# Altium schematic sheet 5VBulkhead.SchDoc
size A4
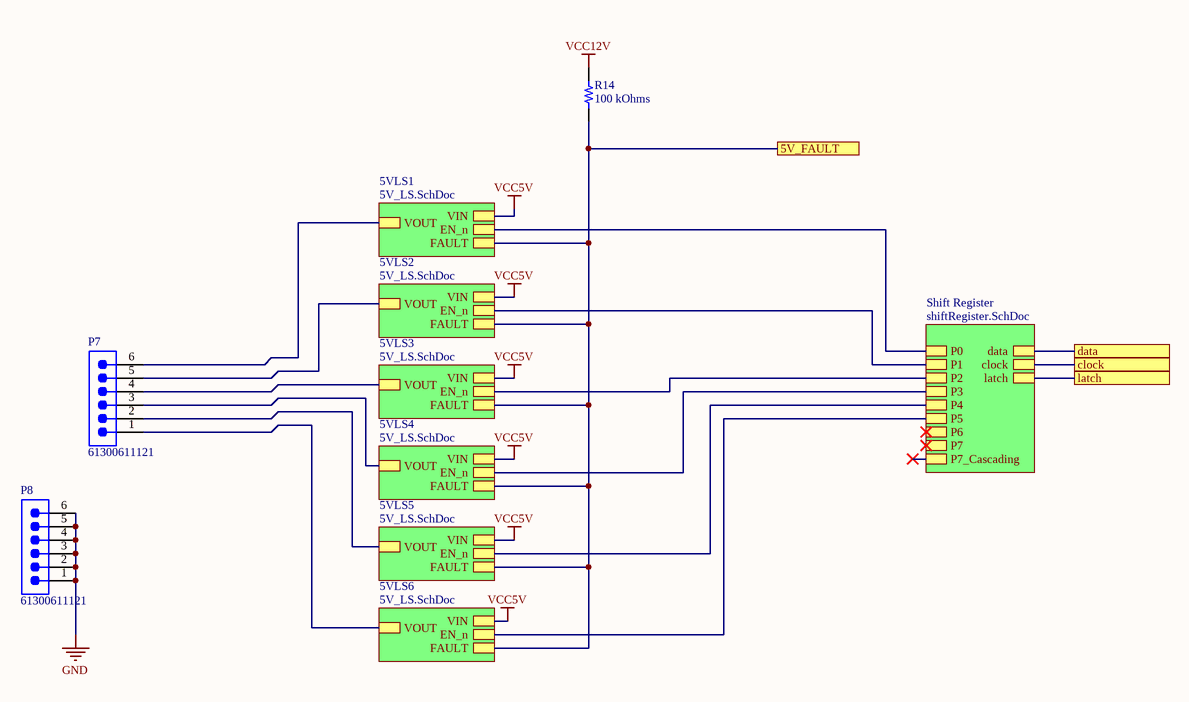
[diagram p0: 5VBulkhead.SchDoc]

## Parts
P7  61300611121  [61300611121]
P8  61300611121  [61300611121]
R14  100 kOhms  [RES 0603_1608]

## Sub-sheets
5VLS1 = 5V_LS.SchDoc: VIN, VOUT, EN_n, FAULT
5VLS2 = 5V_LS.SchDoc: VIN, VOUT, EN_n, FAULT
5VLS3 = 5V_LS.SchDoc: VIN, VOUT, EN_n, FAULT
5VLS4 = 5V_LS.SchDoc: VIN, VOUT, EN_n, FAULT
5VLS5 = 5V_LS.SchDoc: VIN, VOUT, EN_n, FAULT
5VLS6 = 5V_LS.SchDoc: VIN, VOUT, EN_n, FAULT
Shift Register = shiftRegister.SchDoc: P0, P1, P2, P3, P4, P5, P6, P7, P7_Cascading, data, clock, latch

## Ports
5V_FAULT, clock, data, latch

## Nets
GND: P8.1 P8.2 P8.3 P8.4 P8.5 P8.6
VCC5V: sheet 5VLS1/VIN, sheet 5VLS2/VIN, sheet 5VLS3/VIN, sheet 5VLS4/VIN, sheet 5VLS5/VIN, sheet 5VLS6/VIN
VCC12V: R14.2
5V_FAULT: R14.1 ; port 5V_FAULT, sheet 5VLS1/FAULT, sheet 5VLS2/FAULT, sheet 5VLS3/FAULT, sheet 5VLS4/FAULT, sheet 5VLS5/FAULT, sheet 5VLS6/FAULT
clock: port clock, sheet Shift Register/clock
data: port data, sheet Shift Register/data
latch: port latch, sheet Shift Register/latch
NetP7_1: P7.1 ; sheet 5VLS6/VOUT
NetP7_2: P7.2 ; sheet 5VLS5/VOUT
NetP7_3: P7.3 ; sheet 5VLS4/VOUT
NetP7_4: P7.4 ; sheet 5VLS3/VOUT
NetP7_5: P7.5 ; sheet 5VLS2/VOUT
NetP7_6: P7.6 ; sheet 5VLS1/VOUT
(unnamed): sheet Shift Register/P0, sheet 5VLS1/EN_n
(unnamed): sheet Shift Register/P1, sheet 5VLS2/EN_n
(unnamed): sheet Shift Register/P2, sheet 5VLS3/EN_n
(unnamed): sheet Shift Register/P3, sheet 5VLS4/EN_n
(unnamed): sheet Shift Register/P4, sheet 5VLS5/EN_n
(unnamed): sheet Shift Register/P5, sheet 5VLS6/EN_n

## Library data of the parts
P7 P8 = CMP-1502-01070-2: NexarPartId: 20084590; Operating Supply Voltage: 250V; Current Rating: 3A; Number of Contacts: 6; Gender: Male; Connector Type: Male Pin; Pitch: 2.54mm; Contact Resistance: 20mΩ; Lead Free: Lead Free; REACH SVHC: Unknown; Number of Rows: 1; Color: Black; Min Operating Temperature: -40°C; Contact Material: Copper; Lead Pitch: 2.54mm; Contact Plating: Gold; Number of Pins: 6; Height: 8.89mm; Orientation: Vertical; Termination: Through Hole; Mount: Through Hole; RoHS: Compliant; Contact Gender: Male; Contact Mating Length: 5.9944mm; Voltage Rating: 250V; Number of Positions: 6; Housing Material: PBT; Packaging: Bulk; Max Operating Temperature: 105°C
R14 = RNCS0603BKE100K: RES 100K OHM 0.1% 1/16W 0603; Manufacturer: Stackpole Electronics Inc; Power (Watts): 0.063W, 1/16W; Temperature Coefficient: ±25ppm/°C; Part Number: RNCS0603BKE100K; Value: 100 kOhms; ComponentLink1Description: Datasheet; ComponentLink1URL: https://www.seielect.com/catalog/sei-rncs_rnch.pdf; ComponentLink2Description: DigiKey Link; ComponentLink2URL: https://www.digikey.com/en/products/detail/stackpole-electronics-inc/RNCS0603BKE100K/1708835; Composition: Thin Film; Device Package: 0603 (1608 Metric); Features: Anti-Corrosive, Automotive AEC-Q200, Moisture Resistant; Height - Seated (Max): 0.022" (0.55mm); LastUpdated: 2023-06-08 7:45:17 PM; Lifecycle Status: Active; Minimum Order: 1; Number of Terminations: 2; Operating Temperature: -55°C ~ 155°C; Package / Case: 0603 (1608 Metric); Packaging: TapeAndReel; PartId: 4849; Part Status: Active; Price: 0.07; Ratings: AEC-Q200; Resistance: 100 kOhms; Series: RNCS; Size / Dimension: 0.061" L x 0.031" W (1.55mm x 0.80mm); Supplier 1: DigiKey; Supplier Part Number 1: RNCS0603BKE100KCT-ND; Supplier Device Package: 0603; Tolerance: ±0.1%